# Altium schematic sheet RGMII.SchDoc: RGMII FOR CPU
size A4; DrawnBy: ThanhQuoc; Revision: V01; SheetNumber: 18; SheetTotal: 21; Project: RV1126 CAMERA BOARD DESIGN; SPICEModelCacheOPRAEGQT: <root> / <DocumentId>OPRAEGQT</DocumentId> / <CacheFrame Number="0"> / <Model Name="fb_220_adv" Kind="CKT"> / <Text>.SUBCKT FB_220_ADV 1 2 / Rdc 1 2 0.045 / * low freq inductive / L1 1 3 50n / R1 3 2 1 / * high freq loss / R2 1 2 200 / Cpar 1 2 2p / .ends FB_220_ADV</Text> / </Model> / </CacheFrame> / </root>
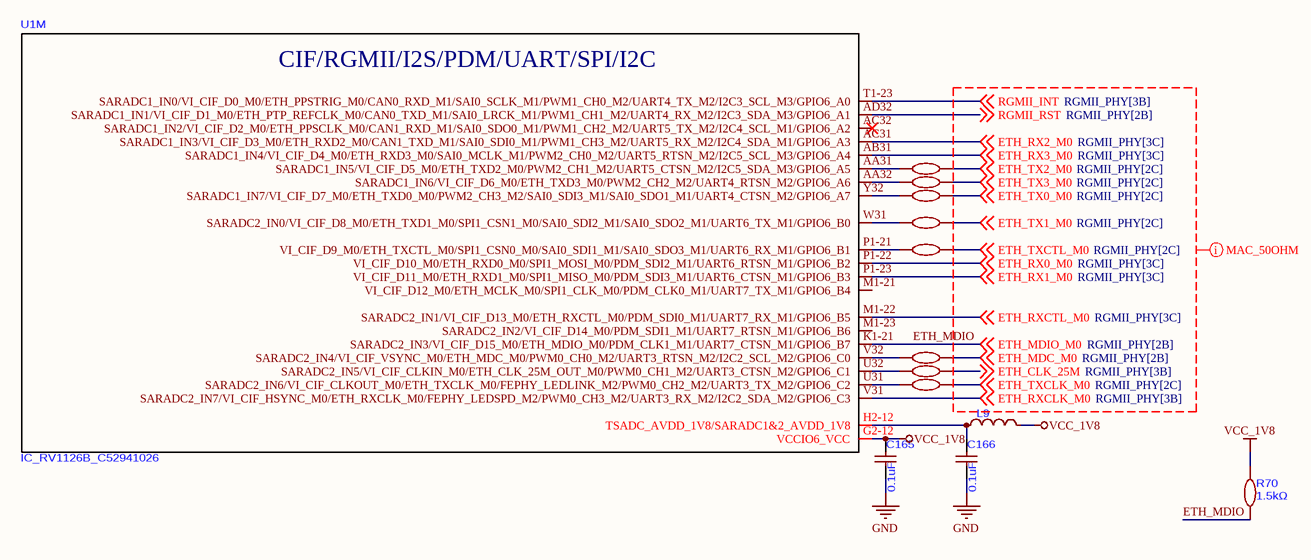
[diagram p0: RGMII.SchDoc]

## Parts
C165  0.1uF  [C0201]
C166  0.1uF  [C0201]
L9  FERRITE BEAD 120Ω 0201 1LN  [R0402]  (value not drawn)
R62  0Ω  [R0201]  (value not drawn)
R63  0Ω  [R0201]  (value not drawn)
R64  0Ω  [R0201]  (value not drawn)
R65  0Ω  [R0201]  (value not drawn)
R66  0Ω  [R0201]  (value not drawn)
R67  0Ω  [R0201]  (value not drawn)
R68  0Ω  [R0201]  (value not drawn)
R69  0Ω  [R0201]  (value not drawn)
R70  1.5kΩ  [R0201]
U1  IC_RV1126B_C52941026  [CCSP-491_L14.0-W14.0-TL_RV1126B]  (part M of 18)

## Nets
GND: C165.1 C166.1
VCC_1V8: C165.2 L9.2 R70.2 U1.G2-12(VCCIO6_VCC)
ETH_CLK_25M: R68.2 ; off-sheet ETH_CLK_25M
ETH_MDC_M0: R67.2 ; off-sheet ETH_MDC_M0
ETH_MDIO: R70.1 U1.K1-21(SARADC2_IN3/VI_CIF_D15_M0/ETH_MDIO_M0/PDM_CLK1_M1/UART7_CTSN_M1/GPIO6_B7) ; off-sheet ETH_MDIO_M0  [also labelled ETH_MDIO_M0]
ETH_RX0_M0: U1.P1-22(VI_CIF_D10_M0/ETH_RXD0_M0/SPI1_MOSI_M0/PDM_SDI2_M1/UART6_RTSN_M1/GPIO6_B2) ; off-sheet ETH_RX0_M0
ETH_RX1_M0: U1.P1-23(VI_CIF_D11_M0/ETH_RXD1_M0/SPI1_MISO_M0/PDM_SDI3_M1/UART6_CTSN_M1/GPIO6_B3) ; off-sheet ETH_RX1_M0
ETH_RX2_M0: U1.AC31(SARADC1_IN3/VI_CIF_D3_M0/ETH_RXD2_M0/CAN1_TXD_M1/SAI0_SDI0_M1/PWM1_CH3_M2/UART5_RX_M2/I2C4_SDA_M1/GPIO6_A3) ; off-sheet ETH_RX2_M0
ETH_RX3_M0: U1.AB31(SARADC1_IN4/VI_CIF_D4_M0/ETH_RXD3_M0/SAI0_MCLK_M1/PWM2_CH0_M2/UART5_RTSN_M2/I2C5_SCL_M3/GPIO6_A4) ; off-sheet ETH_RX3_M0
ETH_RXCLK_M0: U1.V31(SARADC2_IN7/VI_CIF_HSYNC_M0/ETH_RXCLK_M0/FEPHY_LEDSPD_M2/PWM0_CH3_M2/UART3_RX_M2/I2C2_SDA_M2/GPIO6_C3) ; off-sheet ETH_RXCLK_M0
ETH_RXCTL_M0: U1.M1-22(SARADC2_IN1/VI_CIF_D13_M0/ETH_RXCTL_M0/PDM_SDI0_M1/UART7_RX_M1/GPIO6_B5) ; off-sheet ETH_RXCTL_M0
ETH_TX0_M0: R64.2 ; off-sheet ETH_TX0_M0
ETH_TX1_M0: R65.2 ; off-sheet ETH_TX1_M0
ETH_TX2_M0: R62.2 ; off-sheet ETH_TX2_M0
ETH_TX3_M0: R63.2 ; off-sheet ETH_TX3_M0
ETH_TXCLK_M0: R69.2 ; off-sheet ETH_TXCLK_M0
ETH_TXCTL_M0: R66.2 ; off-sheet ETH_TXCTL_M0
RGMII_INT: U1.T1-23(SARADC1_IN0/VI_CIF_D0_M0/ETH_PPSTRIG_M0/CAN0_RXD_M1/SAI0_SCLK_M1/PWM1_CH0_M2/UART4_TX_M2/I2C3_SCL_M3/GPIO6_A0) ; off-sheet RGMII_INT
RGMII_RST: U1.AD32(SARADC1_IN1/VI_CIF_D1_M0/ETH_PTP_REFCLK_M0/CAN0_TXD_M1/SAI0_LRCK_M1/PWM1_CH1_M2/UART4_RX_M2/I2C3_SDA_M3/GPIO6_A1) ; off-sheet RGMII_RST
NetC166_2: C166.2 L9.1 U1.H2-12(TSADC_AVDD_1V8/SARADC1&2_AVDD_1V8)
NetR62_1: R62.1 U1.AA31(SARADC1_IN5/VI_CIF_D5_M0/ETH_TXD2_M0/PWM2_CH1_M2/UART5_CTSN_M2/I2C5_SDA_M3/GPIO6_A5)
NetR63_1: R63.1 U1.AA32(SARADC1_IN6/VI_CIF_D6_M0/ETH_TXD3_M0/PWM2_CH2_M2/UART4_RTSN_M2/GPIO6_A6)
NetR64_1: R64.1 U1.Y32(SARADC1_IN7/VI_CIF_D7_M0/ETH_TXD0_M0/PWM2_CH3_M2/SAI0_SDI3_M1/SAI0_SDO1_M1/UART4_CTSN_M2/GPIO6_A7)
NetR65_1: R65.1 U1.W31(SARADC2_IN0/VI_CIF_D8_M0/ETH_TXD1_M0/SPI1_CSN1_M0/SAI0_SDI2_M1/SAI0_SDO2_M1/UART6_TX_M1/GPIO6_B0)
NetR66_1: R66.1 U1.P1-21(VI_CIF_D9_M0/ETH_TXCTL_M0/SPI1_CSN0_M0/SAI0_SDI1_M1/SAI0_SDO3_M1/UART6_RX_M1/GPIO6_B1)
NetR67_1: R67.1 U1.V32(SARADC2_IN4/VI_CIF_VSYNC_M0/ETH_MDC_M0/PWM0_CH0_M2/UART3_RTSN_M2/I2C2_SCL_M2/GPIO6_C0)
NetR68_1: R68.1 U1.U32(SARADC2_IN5/VI_CIF_CLKIN_M0/ETH_CLK_25M_OUT_M0/PWM0_CH1_M2/UART3_CTSN_M2/GPIO6_C1)
NetR69_1: R69.1 U1.U31(SARADC2_IN6/VI_CIF_CLKOUT_M0/ETH_TXCLK_M0/FEPHY_LEDLINK_M2/PWM0_CH2_M2/UART3_TX_M2/GPIO6_C2)

Not connected (* = marked no-connect by the designer): U1 AC32(SARADC1_IN2/VI_CIF_D2_M0/ETH_PPSCLK_M0/CAN1_RXD_M1/SAI0_SDO0_M1/PWM1_CH2_M2/UART5_TX_M2/I2C4_SCL_M1/GPIO6_A2)* M1-21(VI_CIF_D12_M0/ETH_MCLK_M0/SPI1_CLK_M0/PDM_CLK0_M1/UART7_TX_M1/GPIO6_B4) M1-23(SARADC2_IN2/VI_CIF_D14_M0/PDM_SDI1_M1/UART7_RTSN_M1/GPIO6_B6)

## Layout directives
net class MAC_50OHM: ETH_CLK_25M, ETH_MDC_M0, ETH_MDIO_M0, ETH_RX0_M0, ETH_RX1_M0, ETH_RX2_M0, ETH_RX3_M0, ETH_RXCLK_M0, ETH_RXCTL_M0, ETH_TX0_M0, ETH_TX1_M0, ETH_TX2_M0, ETH_TX3_M0, ETH_TXCLK_M0, ETH_TXCTL_M0, RGMII_INT, RGMII_RST

## Notes on the sheet
- Title:
- Drawn By:
- Page Contents:
- Checked By:
- Size:
- Date:
- File:
- License:
- Email:
- A4
- nguyenthanhquoc0206@gmail.com
- Number:
- Time:
- Revision:
- Sheet
- Website:
- of
- https://www.facebook.com/ntq.687
- (in symbol IC_RV1126B_C52941026, part M) CIF/RGMII/I2S/PDM/UART/SPI/I2C

## Library data of the parts
C165 C166 = CAP_100nF-6.3V-10%-0201_1: 0.1uF ±10% 6.3V Ceramic Capacitor X5R 0201
L9 = MPZ0603S121HT000: 120 Ohms @ 100MHz 1 Power Line Ferrite Bead 0201 1A 130mOhm
R62-R69 = RES_0OHM-50mW-1%-0201: RES 0Ω ±1% 50mW 0201; ComponentLink1Description: LCSC; ComponentLink1URL: https://www.lcsc.com/product-detail/C295718.html?s_z=n_q_t_120%2520OHM&spm=wm.fly.bg.5.xh___wm.ssy.tc.1.tz&lcsc_vid=EwRWBFZSQVIPVFdUTlJfVldeFFRYUFQAElRYBFRRE1MxVlNeRFZeU1BfTlBYVzsOAxUeFF5JWBYZEEoKFBINSQcJGk4eFQsCAgIaSgADAwAHC0slRVhcV1ZTT08GEwkK
R70 = RES_1.5K-0.05W-1%-0201: RES 1500Ω ±1% 0.05W 0201; ComponentLink1Description: LCSC; ComponentLink1URL: https://www.lcsc.com/product-detail/C93949.html?spm=wm.fly.bg.0.xh&lcsc_vid=EwRWBFZSQVIPVFdUTlJfVldeFFRYUFQAElRYBFRRE1MxVlNeRVlXUFNQQ1RWXjsOAxUeFF5JWBYZEEoKFBINSQcJGk4eFQsCAgIaSgADAwAHC0slRlVYUFFIHxUDCw%3D%3D